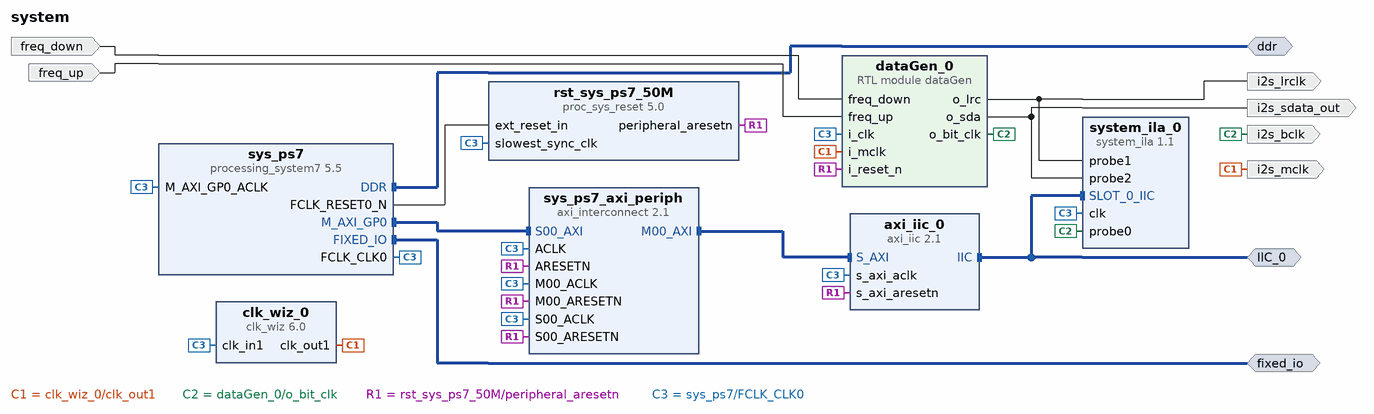
[diagram p0: block diagram of the top level]
# Vivado block design system, xc7z035ifbg676-2L, Vivado 2021.1
create_bd_design system

create_bd_intf_port -mode Master -vlnv xilinx.com:interface:ddrx_rtl:1.0 ddr
create_bd_intf_port -mode Master -vlnv xilinx.com:display_processing_system7:fixedio_rtl:1.0 fixed_io
create_bd_intf_port -mode Master -vlnv xilinx.com:interface:iic_rtl:1.0 IIC_0
create_bd_port -dir O -type clk i2s_mclk
set_property -dict {CONFIG.FREQ_HZ 12288000} [get_bd_ports i2s_mclk]
create_bd_port -dir O -type clk i2s_bclk
create_bd_port -dir O i2s_lrclk
create_bd_port -dir O i2s_sdata_out
create_bd_port -dir I freq_up
create_bd_port -dir I freq_down

create_bd_cell -type ip -vlnv xilinx.com:ip:processing_system7:5.5 sys_ps7
set_property -dict [list \
  CONFIG.PCW_APU_PERIPHERAL_FREQMHZ 666.666666 \
  CONFIG.PCW_CPU_CPU_6X4X_MAX_RANGE 800 \
  CONFIG.PCW_ENET0_PERIPHERAL_ENABLE 0 \
  CONFIG.PCW_ENET1_PERIPHERAL_CLKSRC External \
  CONFIG.PCW_FPGA0_PERIPHERAL_FREQMHZ 100 \
  CONFIG.PCW_FPGA1_PERIPHERAL_FREQMHZ 200.0 \
  CONFIG.PCW_FPGA2_PERIPHERAL_FREQMHZ 200.0 \
  CONFIG.PCW_GPIO_MIO_GPIO_ENABLE 0 \
  CONFIG.PCW_IRQ_F2P_INTR 1 \
  CONFIG.PCW_IRQ_F2P_MODE REVERSE \
  CONFIG.PCW_PERIPHERAL_BOARD_PRESET None \
  CONFIG.PCW_PRESET_BANK0_VOLTAGE {LVCMOS 1.8V} \
  CONFIG.PCW_PRESET_BANK1_VOLTAGE {LVCMOS 1.8V} \
  CONFIG.PCW_QSPI_PERIPHERAL_ENABLE 0 \
  CONFIG.PCW_SD0_PERIPHERAL_ENABLE 0 \
  CONFIG.PCW_UART1_PERIPHERAL_ENABLE 1 \
  CONFIG.PCW_UART1_UART1_IO {MIO 48 .. 49} \
  CONFIG.PCW_UART_PERIPHERAL_FREQMHZ 100 \
  CONFIG.PCW_UIPARAM_DDR_FREQ_MHZ 533.333333 \
  CONFIG.PCW_UIPARAM_DDR_PARTNO {MT41K256M16 RE-125} \
  CONFIG.PCW_USB0_PERIPHERAL_ENABLE 0 \
  CONFIG.PCW_USE_FABRIC_INTERRUPT 1 \
  CONFIG.preset None \
] [get_bd_cells sys_ps7]
# 339 more settings of sys_ps7 are not shown: defaults, MIO pin electricals, DDR timing, and values the tool derives
create_bd_cell -type ip -vlnv xilinx.com:ip:proc_sys_reset:5.0 rst_sys_ps7_50M
create_bd_cell -type ip -vlnv xilinx.com:ip:clk_wiz:6.0 clk_wiz_0
set_property -dict [list \
  CONFIG.CLKOUT1_JITTER 360.948 \
  CONFIG.CLKOUT1_PHASE_ERROR 301.601 \
  CONFIG.CLKOUT1_REQUESTED_OUT_FREQ 12.288 \
  CONFIG.CLKOUT2_JITTER 413.772 \
  CONFIG.CLKOUT2_PHASE_ERROR 250.856 \
  CONFIG.CLKOUT2_REQUESTED_OUT_FREQ 12.288 \
  CONFIG.CLKOUT2_USED false \
  CONFIG.MMCM_CLKFBOUT_MULT_F 48.000 \
  CONFIG.MMCM_CLKOUT0_DIVIDE_F 78.125 \
  CONFIG.MMCM_CLKOUT1_DIVIDE 1 \
  CONFIG.MMCM_DIVCLK_DIVIDE 5 \
  CONFIG.NUM_OUT_CLKS 1 \
  CONFIG.USE_LOCKED false \
  CONFIG.USE_RESET false \
] [get_bd_cells clk_wiz_0]
create_bd_cell -type ip -vlnv xilinx.com:ip:axi_interconnect:2.1 sys_ps7_axi_periph
set_property -dict {CONFIG.NUM_MI 1} [get_bd_cells sys_ps7_axi_periph]
create_bd_cell -type module -reference dataGen dataGen_0
create_bd_cell -type ip -vlnv xilinx.com:ip:axi_iic:2.1 axi_iic_0
create_bd_cell -type ip -vlnv xilinx.com:ip:system_ila:1.1 system_ila_0
set_property -dict [list \
  CONFIG.C_DATA_DEPTH 65536 \
  CONFIG.C_MON_TYPE MIX \
  CONFIG.C_NUM_MONITOR_SLOTS 1 \
  CONFIG.C_NUM_OF_PROBES 3 \
  CONFIG.C_PROBE0_TYPE 0 \
  CONFIG.C_PROBE1_TYPE 0 \
  CONFIG.C_PROBE2_TYPE 0 \
  CONFIG.C_SLOT_0_INTF_TYPE xilinx.com:interface:iic_rtl:1.0 \
  CONFIG.C_SLOT_0_TYPE 0 \
] [get_bd_cells system_ila_0]

# ---- connections ----

connect_bd_intf_net -intf_net axi_iic_0_IIC [get_bd_intf_ports IIC_0] [get_bd_intf_pins axi_iic_0/IIC]
connect_bd_intf_net [get_bd_intf_ports IIC_0] [get_bd_intf_pins system_ila_0/SLOT_0_IIC]
connect_bd_intf_net [get_bd_intf_ports ddr] [get_bd_intf_pins sys_ps7/DDR]
connect_bd_intf_net [get_bd_intf_ports fixed_io] [get_bd_intf_pins sys_ps7/FIXED_IO]
connect_bd_intf_net [get_bd_intf_pins sys_ps7/M_AXI_GP0] [get_bd_intf_pins sys_ps7_axi_periph/S00_AXI]
connect_bd_intf_net [get_bd_intf_pins sys_ps7_axi_periph/M00_AXI] [get_bd_intf_pins axi_iic_0/S_AXI]
connect_bd_net [get_bd_pins clk_wiz_0/clk_out1] [get_bd_ports i2s_mclk] [get_bd_pins dataGen_0/i_mclk]
connect_bd_net -net dataGen_0_o_bit_clk [get_bd_pins dataGen_0/o_bit_clk] [get_bd_ports i2s_bclk] [get_bd_pins system_ila_0/probe0]
connect_bd_net -net dataGen_0_o_lrc [get_bd_pins dataGen_0/o_lrc] [get_bd_ports i2s_lrclk] [get_bd_pins system_ila_0/probe1]
connect_bd_net -net dataGen_0_o_sda [get_bd_pins dataGen_0/o_sda] [get_bd_ports i2s_sdata_out] [get_bd_pins system_ila_0/probe2]
connect_bd_net -net freq_down_0_1 [get_bd_ports freq_down] [get_bd_pins dataGen_0/freq_down]
connect_bd_net -net freq_up_0_1 [get_bd_ports freq_up] [get_bd_pins dataGen_0/freq_up]
connect_bd_net [get_bd_pins rst_sys_ps7_50M/peripheral_aresetn] \
  [get_bd_pins sys_ps7_axi_periph/S00_ARESETN] [get_bd_pins sys_ps7_axi_periph/M00_ARESETN] \
  [get_bd_pins sys_ps7_axi_periph/ARESETN] [get_bd_pins dataGen_0/i_reset_n] [get_bd_pins axi_iic_0/s_axi_aresetn]
connect_bd_net -net sys_cpu_clk [get_bd_pins sys_ps7/FCLK_CLK0] \
  [get_bd_pins sys_ps7/M_AXI_GP0_ACLK] [get_bd_pins rst_sys_ps7_50M/slowest_sync_clk] [get_bd_pins clk_wiz_0/clk_in1] \
  [get_bd_pins sys_ps7_axi_periph/S00_ACLK] [get_bd_pins sys_ps7_axi_periph/M00_ACLK] [get_bd_pins sys_ps7_axi_periph/ACLK] \
  [get_bd_pins dataGen_0/i_clk] [get_bd_pins axi_iic_0/s_axi_aclk] [get_bd_pins system_ila_0/clk]
connect_bd_net [get_bd_pins sys_ps7/FCLK_RESET0_N] [get_bd_pins rst_sys_ps7_50M/ext_reset_in]
set_property HDL_ATTRIBUTE.DEBUG true [get_bd_intf_nets axi_iic_0_IIC]
set_property HDL_ATTRIBUTE.MARK_DEBUG true [get_bd_intf_nets axi_iic_0_IIC]
set_property HDL_ATTRIBUTE.DEBUG true [get_bd_nets dataGen_0_o_bit_clk]
set_property HDL_ATTRIBUTE.MARK_DEBUG true [get_bd_nets dataGen_0_o_bit_clk]
set_property HDL_ATTRIBUTE.DEBUG true [get_bd_nets dataGen_0_o_lrc]
set_property HDL_ATTRIBUTE.MARK_DEBUG true [get_bd_nets dataGen_0_o_lrc]
set_property HDL_ATTRIBUTE.DEBUG true [get_bd_nets dataGen_0_o_sda]
set_property HDL_ATTRIBUTE.MARK_DEBUG true [get_bd_nets dataGen_0_o_sda]

# ---- address map ----
assign_bd_address -offset 0x41600000 -range 64K -target_address_space [get_bd_addr_spaces sys_ps7/Data] [get_bd_addr_segs axi_iic_0/S_AXI/Reg]

validate_bd_design
save_bd_design
